# Altium schematic sheet ppc_net.SchDoc: PowePC Gigabit Ethernet
size A3; Date: DO NOT USE, RATHER USE PROJ OPTIONS; DrawnBy: DO NOT USE, RATHER USE PROJ OPTIONS; Engineer: DO NOT USE, RATHER USE PROJ OPTIONS; Organization: DO NOT USE, RATHER USE PROJ OPTIONS; DocumentNumber: DO NOT USE, RATHER USE PROJ OPTIONS; Revision: DO NOT USE, RATHER USE PROJ OPTIONS; SheetNumber: 11; SheetTotal: 27; SCH_Sheet_Filename: ppc_net.SchDoc; CurrentTime: DO NOT USE, RATHER USE PROJ OPTIONS; Time: DO NOT USE, RATHER USE PROJ OPTIONS; DocumentFullPathAndName: DO NOT USE, RATHER USE PROJ OPTIONS; DocumentName: DO NOT USE, RATHER USE PROJ OPTIONS; ModifiedDate: DO NOT USE, RATHER USE PROJ OPTIONS; ImagePath: DO NOT USE, RATHER USE PROJ OPTIONS
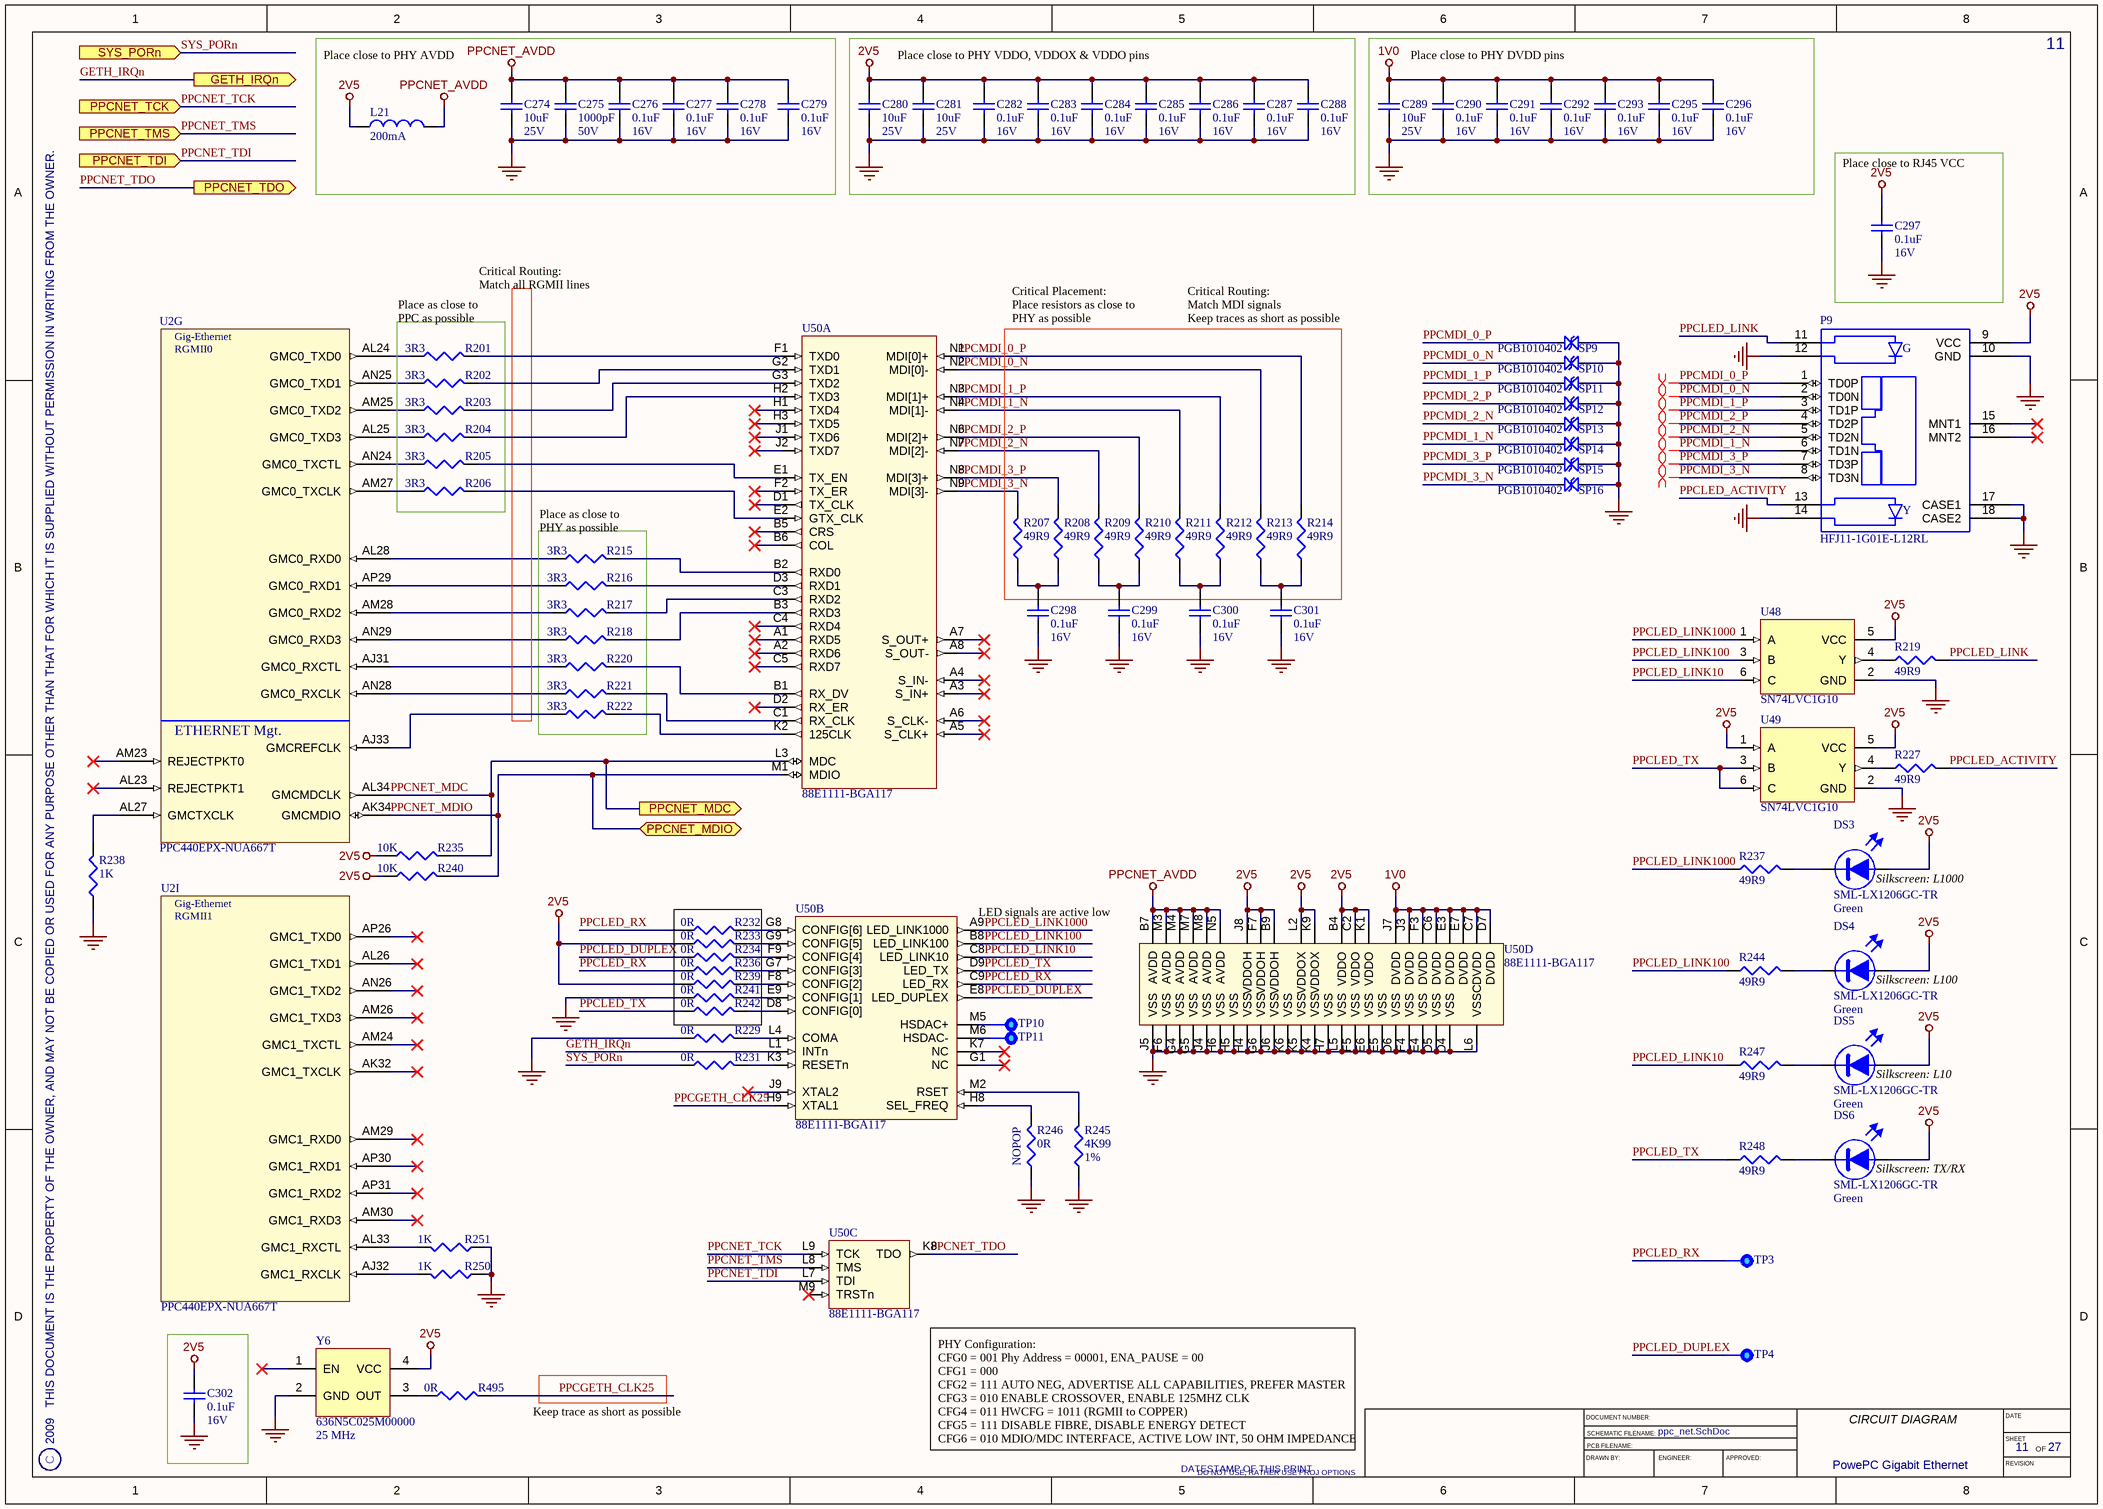
[diagram p0: ppc_net.SchDoc]

## Parts
C274  Rating: 25V  [CAPC3225X200L]  (hidden comment: 10uF)
C275  Rating: 50V  [CAPC1005X55L]  (hidden comment: 1000pF)
C276  Rating: 16V  [CAPC1005X60L]  (hidden comment: 0.1uF)
C277  Rating: 16V  [CAPC1005X60L]  (hidden comment: 0.1uF)
C278  Rating: 16V  [CAPC1005X60L]  (hidden comment: 0.1uF)
C279  Rating: 16V  [CAPC1005X60L]  (hidden comment: 0.1uF)
C280  Rating: 25V  [CAPC3225X200L]  (hidden comment: 10uF)
C281  Rating: 25V  [CAPC3225X200L]  (hidden comment: 10uF)
C282  Rating: 16V  [CAPC1005X60L]  (hidden comment: 0.1uF)
C283  Rating: 16V  [CAPC1005X60L]  (hidden comment: 0.1uF)
C284  Rating: 16V  [CAPC1005X60L]  (hidden comment: 0.1uF)
C285  Rating: 16V  [CAPC1005X60L]  (hidden comment: 0.1uF)
C286  Rating: 16V  [CAPC1005X60L]  (hidden comment: 0.1uF)
C287  Rating: 16V  [CAPC1005X60L]  (hidden comment: 0.1uF)
C288  Rating: 16V  [CAPC1005X60L]  (hidden comment: 0.1uF)
C289  Rating: 25V  [CAPC3225X200L]  (hidden comment: 10uF)
C290  Rating: 16V  [CAPC1005X60L]  (hidden comment: 0.1uF)
C291  Rating: 16V  [CAPC1005X60L]  (hidden comment: 0.1uF)
C292  Rating: 16V  [CAPC1005X60L]  (hidden comment: 0.1uF)
C293  Rating: 16V  [CAPC1005X60L]  (hidden comment: 0.1uF)
C295  Rating: 16V  [CAPC1005X60L]  (hidden comment: 0.1uF)
C296  Rating: 16V  [CAPC1005X60L]  (hidden comment: 0.1uF)
C297  Rating: 16V  [CAPC1005X60L]  (hidden comment: 0.1uF)
C298  Rating: 16V  [CAPC1005X60L]  (hidden comment: 0.1uF)
C299  Rating: 16V  [CAPC1005X60L]  (hidden comment: 0.1uF)
C300  Rating: 16V  [CAPC1005X60L]  (hidden comment: 0.1uF)
C301  Rating: 16V  [CAPC1005X60L]  (hidden comment: 0.1uF)
C302  Rating: 16V  [CAPC1005X60L]  (hidden comment: 0.1uF)
DS3  SML-LX1206GC-TR  Colour: Green  [LEDC3216X120N]
DS4  SML-LX1206GC-TR  Colour: Green  [LEDC3216X120N]
DS5  SML-LX1206GC-TR  Colour: Green  [LEDC3216X120N]
DS6  SML-LX1206GC-TR  Colour: Green  [LEDC3216X120N]
L21  Rating: 200mA  [INDC2012X130L]  (hidden comment: 600R)
P9  HFJ11-1G01E-L12RL  [HALO_HFJ11-1G02E-L55]
R201  3R3  [RESC1005X40L]
R202  3R3  [RESC1005X40L]
R203  3R3  [RESC1005X40L]
R204  3R3  [RESC1005X40L]
R205  3R3  [RESC1005X40L]
R206  3R3  [RESC1005X40L]
R207  49R9  [RESC1005X40L]
R208  49R9  [RESC1005X40L]
R209  49R9  [RESC1005X40L]
R210  49R9  [RESC1005X40L]
R211  49R9  [RESC1005X40L]
R212  49R9  [RESC1005X40L]
R213  49R9  [RESC1005X40L]
R214  49R9  [RESC1005X40L]
R215  3R3  [RESC1005X40L]
R216  3R3  [RESC1005X40L]
R217  3R3  [RESC1005X40L]
R218  3R3  [RESC1005X40L]
R219  49R9  [RESC1005X40L]
R220  3R3  [RESC1005X40L]
R221  3R3  [RESC1005X40L]
R222  3R3  [RESC1005X40L]
R227  49R9  [RESC1005X40L]
R229  0R  [RESC1005X40L]
R231  0R  [RESC1005X40L]
R232  0R  [RESC1005X40L]
R233  0R  [RESC1005X40L]
R234  0R  [RESC1005X40L]
R235  10K  [RESC1005X40L]
R236  0R  [RESC1005X40L]
R237  49R9  [RESC1005X40L]
R238  1K  [RESC1005X40L]
R239  0R  [RESC1005X40L]
R240  10K  [RESC1005X40L]
R241  0R  [RESC1005X40L]
R242  0R  [RESC1005X40L]
R244  49R9  [RESC1005X40L]
R245  Tolerance: 1%  [RESC1005X40L]  (hidden comment: 4K99)
R246  0R  [RESC1005X40L]
R247  49R9  [RESC1005X40L]
R248  49R9  [RESC1005X40L]
R250  1K  [RESC1005X40L]
R251  1K  [RESC1005X40L]
R495  0R  [RESC1005X40L]
SP9  PGB1010402  [PGB1010402]
SP10  PGB1010402  [PGB1010402]
SP11  PGB1010402  [PGB1010402]
SP12  PGB1010402  [PGB1010402]
SP13  PGB1010402  [PGB1010402]
SP14  PGB1010402  [PGB1010402]
SP15  PGB1010402  [PGB1010402]
SP16  PGB1010402  [PGB1010402]
TP3  Testpoint  [TP100]  (value not drawn)  (no BOM)
TP4  Testpoint  [TP100]  (value not drawn)  (no BOM)
TP10  Testpoint  [TP100]  (value not drawn)  (no BOM)
TP11  Testpoint  [TP100]  (value not drawn)  (no BOM)
U2  PPC440EPX-NUA667T  [TE-PBGA680]  (parts G,I of 11)
U48  SN74LVC1G10  [SOT23-6]
U49  SN74LVC1G10  [SOT23-6]
U50  88E1111-BGA117  [BGA117C100P13X9_1400X1000X154]  (parts A,B,C,D of 4)
Y6  Frequency: 25 MHz  [636XXXXXXMXXXXX]  (hidden comment: 636N5C025M00000)

## Ports
GETH_IRQn (out), PPCNET_MDC (out), PPCNET_MDIO (bidir), PPCNET_TCK (in), PPCNET_TDI (in), PPCNET_TDO (out), PPCNET_TMS (in), SYS_PORn (in)

## Nets
1V0: C289.2 C290.2 C291.2 C292.2 C293.2 C295.2 C296.2 U50.C6(DVDD) U50.C7(DVDD) U50.D7(DVDD) U50.E3(DVDD) U50.E7(DVDD) U50.F3(DVDD) U50.J3(DVDD) U50.J7(DVDD)
2V5: C280.2 C281.2 C282.2 C283.2 C284.2 C285.2 C286.2 C287.2 C288.2 C297.2 C302.2 DS3.2(A) DS4.2(A) DS5.2(A) DS6.2(A) L21.1 P9.9(VCC) R233.1 R235.1 R239.1 R240.1 U48.5(VCC) U49.1(A) U49.5(VCC) U50.B4(VDDO) U50.B9(VDDOH) U50.C2(VDDO) U50.F7(VDDOH) U50.J8(VDDOH) U50.K1(VDDO) U50.K9(VDDOX) U50.L2(VDDOX) Y6.4(VCC)
GND: C274.1 C275.1 C276.1 C277.1 C278.1 C279.1 C280.1 C281.1 C282.1 C283.1 C284.1 C285.1 C286.1 C287.1 C288.1 C289.1 C290.1 C291.1 C292.1 C293.1 C295.1 C296.1 C297.1 C298.2 C299.2 C300.2 C301.2 C302.1 P9.10(GND) P9.12(R1_YA_GC) P9.14(L1_YA_GC) P9.17(CASE1) P9.18(CASE2) R229.1 R238.1 R241.1 R245.1 R246.1 R250.1 R251.1 SP9.1(A) SP10.1(A) SP11.1(A) SP12.1(A) SP13.1(A) SP14.1(A) SP15.1(A) SP16.1(A) U48.2(GND) U49.2(GND) U50.D4(VSS) U50.D5(VSS) U50.D6(VSS) U50.E4(VSS) U50.E5(VSS) U50.E6(VSS) U50.F4(VSS) U50.F5(VSS) U50.F6(VSS) U50.G4(VSS) U50.G5(VSS) U50.G6(VSS) U50.H4(VSS) U50.H5(VSS) U50.H6(VSS) U50.H7(VSS) U50.J4(VSS) U50.J5(VSS) U50.J6(VSS) U50.K4(VSS) U50.K5(VSS) U50.K6(VSS) U50.L5(VSS) U50.L6(VSSC) Y6.2(GND)
PPCNET_AVDD: C274.2 C275.2 C276.2 C277.2 C278.2 C279.2 L21.2 U50.B7(AVDD) U50.M3(AVDD) U50.M4(AVDD) U50.M7(AVDD) U50.M8(AVDD) U50.N5(AVDD)
GETH_IRQn: U50.L1(INTn) ; port GETH_IRQn
PPCGETH_CLK25: R495.2 U50.H9(XTAL1)
PPCLED_ACTIVITY: P9.13(L1_YC_GA) R227.2
PPCLED_DUPLEX: R234.1 TP4.1 U50.E8(LED_DUPLEX)
PPCLED_LINK: P9.11(R1_YC_GA) R219.2
PPCLED_LINK10: R247.1 U48.6(C) U50.C8(LED_LINK10)
PPCLED_LINK100: R244.1 U48.3(B) U50.B8(LED_LINK100)
PPCLED_LINK1000: R237.1 U48.1(A) U50.A9(LED_LINK1000)
PPCLED_RX: R232.1 R236.1 TP3.1 U50.C9(LED_RX)
PPCLED_TX: R242.1 R248.1 U49.3(B) U49.6(C) U50.D9(LED_TX)
PPCMDI_0_N: P9.2(TD0N) R213.2 SP10.2(B) U50.N2(MDI[0]-)
PPCMDI_0_P: P9.1(TD0P) R214.2 SP9.2(B) U50.N1(MDI[0]+)
PPCMDI_1_N: P9.6(TD1N) R211.2 SP14.2(B) U50.N4(MDI[1]-)
PPCMDI_1_P: P9.3(TD1P) R212.2 SP11.2(B) U50.N3(MDI[1]+)
PPCMDI_2_N: P9.5(TD2N) R209.2 SP13.2(B) U50.N7(MDI[2]-)
PPCMDI_2_P: P9.4(TD2P) R210.2 SP12.2(B) U50.N6(MDI[2]+)
PPCMDI_3_N: P9.8(TD3N) R207.2 SP16.2(B) U50.N9(MDI[3]-)
PPCMDI_3_P: P9.7(TD3P) R208.2 SP15.2(B) U50.N8(MDI[3]+)
PPCNET_MDC: R235.2 U2.AL34(GMCMDCLK) U50.L3(MDC) ; port PPCNET_MDC
PPCNET_MDIO: R240.2 U2.AK34(GMCMDIO) U50.M1(MDIO) ; port PPCNET_MDIO
PPCNET_TCK: U50.L9(TCK) ; port PPCNET_TCK
PPCNET_TDI: U50.L7(TDI) ; port PPCNET_TDI
PPCNET_TDO: U50.K8(TDO) ; port PPCNET_TDO
PPCNET_TMS: U50.L8(TMS) ; port PPCNET_TMS
SYS_PORn: R231.1 ; port SYS_PORn
NetC298_1: C298.1 R207.1 R208.1
NetC299_1: C299.1 R209.1 R210.1
NetC300_1: C300.1 R211.1 R212.1
NetC301_1: C301.1 R213.1 R214.1
NetDS3_1: DS3.1(K) R237.2
NetDS4_1: DS4.1(K) R244.2
NetDS5_1: DS5.1(K) R247.2
NetDS6_1: DS6.1(K) R248.2
NetR201_1: R201.1 U2.AL24(GMC0_TXD0)
NetR201_2: R201.2 U50.F1(TXD0)
NetR202_1: R202.1 U2.AN25(GMC0_TXD1)
NetR202_2: R202.2 U50.G2(TXD1)
NetR203_1: R203.1 U2.AM25(GMC0_TXD2)
NetR203_2: R203.2 U50.G3(TXD2)
NetR204_1: R204.1 U2.AL25(GMC0_TXD3)
NetR204_2: R204.2 U50.H2(TXD3)
NetR205_1: R205.1 U2.AN24(GMC0_TXCTL)
NetR205_2: R205.2 U50.E1(TX_EN)
NetR206_1: R206.1 U2.AM27(GMC0_TXCLK)
NetR206_2: R206.2 U50.E2(GTX_CLK)
NetR215_1: R215.1 U2.AL28(GMC0_RXD0)
NetR215_2: R215.2 U50.B2(RXD0)
NetR216_1: R216.1 U2.AP29(GMC0_RXD1)
NetR216_2: R216.2 U50.D3(RXD1)
NetR217_1: R217.1 U2.AM28(GMC0_RXD2)
NetR217_2: R217.2 U50.C3(RXD2)
NetR218_1: R218.1 U2.AN29(GMC0_RXD3)
NetR218_2: R218.2 U50.B3(RXD3)
NetR219_1: R219.1 U48.4(Y)
NetR220_1: R220.1 U2.AJ31(GMC0_RXCTL)
NetR220_2: R220.2 U50.B1(RX_DV)
NetR221_1: R221.1 U2.AN28(GMC0_RXCLK)
NetR221_2: R221.2 U50.C1(RX_CLK)
NetR222_1: R222.1 U2.AJ33(GMCREFCLK)
NetR222_2: R222.2 U50.K2(125CLK)
NetR227_1: R227.1 U49.4(Y)
NetR229_2: R229.2 U50.L4(COMA)
NetR231_2: R231.2 U50.K3(RESETn)
NetR232_2: R232.2 U50.G8(CONFIG[6])
NetR233_2: R233.2 U50.G9(CONFIG[5])
NetR234_2: R234.2 U50.F9(CONFIG[4])
NetR236_2: R236.2 U50.G7(CONFIG[3])
NetR238_2: R238.2 U2.AL27(GMCTXCLK)
NetR239_2: R239.2 U50.F8(CONFIG[2])
NetR241_2: R241.2 U50.E9(CONFIG[1])
NetR242_2: R242.2 U50.D8(CONFIG[0])
NetR245_2: R245.2 U50.M2(RSET)
NetR246_2: R246.2 U50.H8(SEL_FREQ)
NetR250_2: R250.2 U2.AJ32(GMC1_RXCLK)
NetR251_2: R251.2 U2.AL33(GMC1_RXCTL)
NetR495_1: R495.1 Y6.3(OUT)
NetTP10_1: TP10.1 U50.M5(HSDAC+)
NetTP11_1: TP11.1 U50.M6(HSDAC-)

Not connected (* = marked no-connect by the designer): P9 15(MNT1)* 16(MNT2)*; U2 AK32(GMC1_TXCLK)* AL23(REJECTPKT1)* AL26(GMC1_TXD1)* AM23(REJECTPKT0)* AM24(GMC1_TXCTL)* AM26(GMC1_TXD3)* AM29(GMC1_RXD0)* AM30(GMC1_RXD3)* AN26(GMC1_TXD2)* AP26(GMC1_TXD0)* AP30(GMC1_RXD1)* AP31(GMC1_RXD2)*; U50 A1(RXD5)* A2(RXD6)* A3(S_IN+)* A4(S_IN-)* A5(S_CLK+)* A6(S_CLK-)* A7(S_OUT+)* A8(S_OUT-)* B5(CRS)* B6(COL)* C4(RXD4)* C5(RXD7)* D1(TX_CLK)* D2(RX_ER)* F2(TX_ER)* G1(NC)* H1(TXD4)* H3(TXD5)* J1(TXD6)* J2(TXD7)* J9(XTAL2)* K7(NC)* M9(TRSTn)*; Y6 1(EN)*

## Layout directives
differential pair: PPCMDI_0_N, PPCMDI_0_P, PPCMDI_1_N, PPCMDI_1_P, PPCMDI_2_N, PPCMDI_2_P, PPCMDI_3_N, PPCMDI_3_P

## Notes on the sheet
- Place close to PHY AVDD
- Place close to PHY VDDO, VDDOX & VDDO pins
- Place close to PHY DVDD pins
- (near C297) Place close to RJ45 VCC
- (near R201) Place as close to
  PPC as possible
- Critical Routing:
  Match all RGMII lines
- Critical Placement:
  Place resistors as close to
  PHY as possible
- Critical Routing:
  Match MDI signals
  Keep traces as short as possible
- (near R215) Place as close to
  PHY as possible
- (near U50) LED signals are active low
- (near DS3) Silkscreen: L1000
- (near DS4) Silkscreen: L100
- (near DS5) Silkscreen: L10
- (near R246) NOPOP
- (near DS6) Silkscreen: TX/RX
- Keep trace as short as possible
- (near U50) PHY Configuration:
  CFG0 = 001 Phy Address = 00001, ENA_PAUSE = 00
  CFG1 = 000
  CFG2 = 111 AUTO NEG, ADVERTISE ALL CAPABILITIES, PREFER MASTER
  CFG3 = 010 ENABLE CROSSOVER, ENABLE 125MHZ CLK
  CFG4 = 011 HWCFG = 1011 (RGMII to COPPER)
  CFG5 = 111 DISABLE FIBRE, DISABLE ENERGY DETECT
  CFG6 = 010 MDIO/MDC INTERFACE, ACTIVE LOW INT, 50 OHM IMPEDANCE
- 2009   THIS DOCUMENT IS THE PROPERTY OF THE OWNER, AND MAY NOT BE COPIED OR USED FOR ANY PURPOSE OTHER THAN THAT FOR WHICH IT IS SUPPLIED WITHOUT PERMISSION IN WRITING FROM THE OWNER.
- C
- DATESTAMP OF THIS PRINT
- DRAWN BY:
- DOCUMENT NUMBER:
- SCHEMATIC FILENAME:
- PCB FILENAME:
- ENGINEER:
- APPROVED:
- CIRCUIT DIAGRAM
- DATE
- SHEET
- REVISION
- OF
- (in symbol CONN-PCB-4) G
- (in symbol IC-CPU-1, part G) Gig-Ethernet; RGMII0; ETHERNET Mgt.
- (in symbol IC-CPU-1, part I) Gig-Ethernet; RGMII1

## Library data of the parts
C274 C280 C281 C289 = CAP-CER-5: 10uF, Ceramic Capacitor; Manufacturer: MURATA; PartNum: GRM32DR61E106KA12L; Tolerance: 10%; Dielectric: X5R; POD number: CAP-CER-5; Value: 10uF; RoHS: Y; Sort Value: 100; Category: Capacitors; Subcategory: Ceramic
C275 = CAP-CER-4: 1000pF, Ceramic Capacitor; Manufacturer: MURATA; PartNum: GRM155R61H102KA01D; Tolerance: 10%; Dielectric: X5R; POD number: CAP-CER-4; Value: 1000pF; RoHS: Y; Sort Value: 0.0001; Category: Capacitors; Subcategory: Ceramic
C276-C279 C282-C288 C290-C293 C295-C302 = CAP-CER-1: 0.1uF, Ceramic Capacitor; Manufacturer: VENKEL; PartNum: C0402X7R160-104KN; Tolerance: 10%; Dielectric: X7R; POD number: CAP-CER-1; Value: 0.1uF; RoHS: Y; Sort Value: 0.1; Category: Capacitors; Subcategory: Ceramic
DS3-DS6 = OPTO-LED-0: Green, Surface mount, LED, 1206; Manufacturer: LUMEX; Vdrop: 2.2V; Rating: 20mA; POD number: OPTO-LED-0; PartNum: SML-LX1206GC-TR; RoHS: Y; Category: OPTO; Subcategory: LED
L21 = IND-FB-0: 600 Ohm, Chip Ferrite Bead; Manufacturer: Murata; PartNum: BLM21BD601SN1; DC Res: 0.35R; Tolerance: 25%; POD number: IND-FB-0; RoHS: Y; Value: 600R; Sort Value: 600; Category: Inductors; Subcategory: FerriteBead
P9 = CONN-PCB-4: RJ45 with Integrated magnetic and dual LEDs; Manufacturer: HALO; POD number: CONN-PCB-4; PartNum: HFJ11-1G01E-L12RL; RoHS: Y; Category: CONN; Subcategory: PCB
R201-R206 R215-R218 R220-R222 = RES-TF-24: 3R3, 1.1mm x 0.5mm, Thick Film Resistor; Manufacturer: ROYALOHM; PartNum: 0402WGJ330KT1E; Tolerance: 5%; Rating: 0.0625W; POD number: RES-TF-24; Value: 3R3; Sort Value: 3R3; Category: Resistors; Subcategory: ThickFilm; HelpURL: *.pdf
R207-R214 R219 R227 R237 R244 R247 R248 = RES-TF-10: 49R9, 1.1mm x 0.5mm, Thick Film Resistor; Manufacturer: ROYALOHM; PartNum: 0402WGF499JT1E; Tolerance: 1%; Rating: 0.0625W; POD number: RES-TF-10; Value: 49R9; Sort Value: 49.9; Category: Resistors; Subcategory: ThickFilm; HelpURL: *.pdf
R229 R231-R234 R236 R239 R241 R242 R246 R495 = RES-TF-0: 0R, 1.1mm x 0.5mm, Thick Film Resistor; Manufacturer: ROYALOHM; PartNum: 0402WG00000T1E; Tolerance: 0%; Rating: 0.0625W; POD number: RES-TF-0; Value: 0R; Sort Value: 0; Category: Resistors; Subcategory: ThickFilm; HelpURL: *.pdf
R235 R240 = RES-TF-5: 10K, 1.1mm x 0.5mm, Thick Film Resistor; Manufacturer: ROYALOHM; PartNum: 0402WGJ0103T1E; Tolerance: 5%; Rating: 0.0625W; POD number: RES-TF-5; Value: 10K; Sort Value: 10000; Category: Resistors; Subcategory: ThickFilm; HelpURL: *.pdf
R238 R250 R251 = RES-TF-8: 1K, 1.1mm x 0.5mm, Thick Film Resistor; Manufacturer: ROYALOHM; PartNum: 0402WGJ0102T1E; Tolerance: 5%; Rating: 0.0625W; POD number: RES-TF-8; Value: 1K; Sort Value: 1000; Category: Resistors; Subcategory: ThickFilm; HelpURL: *.pdf
R245 = RES-TF-13: 4K99, 1.1mm x 0.5mm, Thick Film Resistor; Manufacturer: ROYALOHM; PartNum: 0402WGF4991T1E; Rating: 0.0625W; POD number: RES-TF-13; Value: 4K99; Sort Value: 4990; Category: Resistors; Subcategory: ThickFilm; HelpURL: *.pdf
SP9-SP16 = ELMECH-ESD-3: Surface Mount Polymeric ESD Suppressor in an 0402 package; POD number: ELMECH-ESD-3; PartNum: PGB1010402
TP3 TP4 TP10 TP11 = ELMECH-TP-0: 1mm Diameter, through-hole, Circular Test-point; POD number: ELMECH-TP-0; RoHS: Y; Category: ELMECH; Subcategory: Test Points
U2 = IC-CPU-1: 667MHz, non-RoHS, PPC440EPx uProcessor; Manufacturer: Applied Micro; POD number: IC-CPU-1; PartNum: PPC440EPX-NUA667T; RoHS: Y; Category: IC; Subcategory: CPU
U48 U49 = IC-LOG-3: Single 3-input Positive-NAND gate; Manufacturer: Texas Instruments; POD number: IC-LOG-3; PartNum: SN74LVC1G10; RoHS: Y; Category: IC; Subcategory: Logic
U50 = IC-PHY-1: Integrated 10/100/1000 Ultra Gigabit Ethernet Transceiver; Manufacturer: Marvell; PartNum: 88E1111-XX-BAB1C000; POD number: IC-PHY-1; RoHS: Y; Category: IC; Subcategory: Network PHY
Y6 = RESN-CLK-5: 25.00 MHz, 2V5, CTS 636 clock oscillator; Stability: 50 PPM; POD number: RESN-CLK-5; PartNum: 636N5C025M00000; Manufacturer: CTS; RoHS: Y; Category: RESN; Subcategory: Clock Oscillators